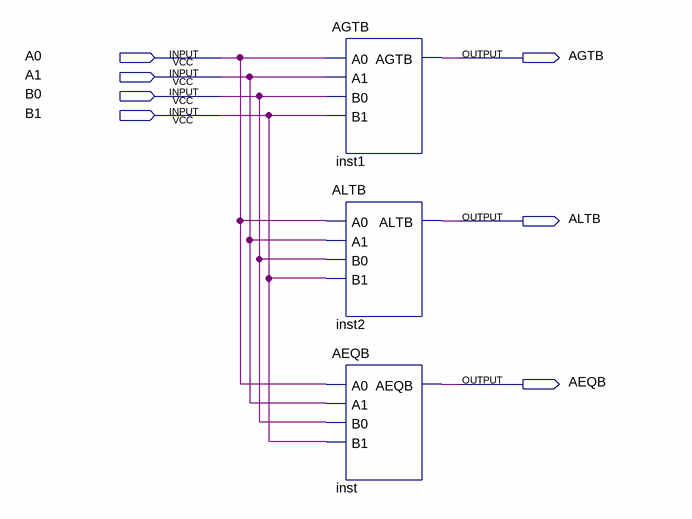
[diagram p0: schematic sheet]
// Quartus schematic Lab1_2bitMultiplexer.bdf as structural Verilog: 3 symbols, 7 pins
module Lab1_2bitMultiplexer (
  input  A0,
  input  A1,
  input  B0,
  input  B1,
  output AGTB,
  output ALTB,
  output AEQB
);

  AGTB inst1 (.A0(A0), .A1(A1), .B0(B0), .B1(B1), .AGTB(AGTB));
  ALTB inst2 (.A0(A0), .A1(A1), .B0(B0), .B1(B1), .ALTB(ALTB));
  AEQB inst (.A0(A0), .A1(A1), .B0(B0), .B1(B1), .AEQB(AEQB));
endmodule
